# EAGLE design pokey (EAGLE 6.6.0)
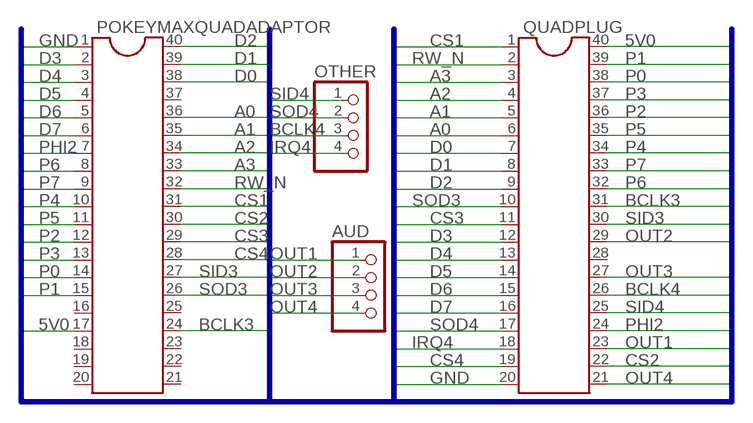
[diagram p0: schematic, sheet 1]

## Parts
AUD  PINHD-1X4  [1X04]
OTHER  PINHD-1X4  [1X04]
POKEYMAXQUADADAPTOR  DIL40  [DIL40]
QUADPLUG  DIL40  [DIL40]

## Nets
5V0: POKEYMAXQUADADAPTOR.17 QUADPLUG.40
A0: POKEYMAXQUADADAPTOR.36 QUADPLUG.6
A1: POKEYMAXQUADADAPTOR.35 QUADPLUG.5
A2: POKEYMAXQUADADAPTOR.34 QUADPLUG.4
A3: POKEYMAXQUADADAPTOR.33 QUADPLUG.3
BCLK3: POKEYMAXQUADADAPTOR.24 QUADPLUG.31
BCLK4: OTHER.3 QUADPLUG.26
CS1: POKEYMAXQUADADAPTOR.31 QUADPLUG.1
CS2: POKEYMAXQUADADAPTOR.30 QUADPLUG.22
CS3: POKEYMAXQUADADAPTOR.29 QUADPLUG.11
CS4: POKEYMAXQUADADAPTOR.28 QUADPLUG.19
D0: POKEYMAXQUADADAPTOR.38 QUADPLUG.7
D1: POKEYMAXQUADADAPTOR.39 QUADPLUG.8
D2: POKEYMAXQUADADAPTOR.40 QUADPLUG.9
D3: POKEYMAXQUADADAPTOR.2 QUADPLUG.12
D4: POKEYMAXQUADADAPTOR.3 QUADPLUG.13
D5: POKEYMAXQUADADAPTOR.4 QUADPLUG.14
D6: POKEYMAXQUADADAPTOR.5 QUADPLUG.15
D7: POKEYMAXQUADADAPTOR.6 QUADPLUG.16
GND: POKEYMAXQUADADAPTOR.1 QUADPLUG.20
IRQ4: OTHER.4 QUADPLUG.18
OUT1: AUD.1 QUADPLUG.23
OUT2: AUD.2 QUADPLUG.29
OUT3: AUD.3 QUADPLUG.27
OUT4: AUD.4 QUADPLUG.21
P0: POKEYMAXQUADADAPTOR.14 QUADPLUG.38
P1: POKEYMAXQUADADAPTOR.15 QUADPLUG.39
P2: POKEYMAXQUADADAPTOR.12 QUADPLUG.36
P3: POKEYMAXQUADADAPTOR.13 QUADPLUG.37
P4: POKEYMAXQUADADAPTOR.10 QUADPLUG.34
P5: POKEYMAXQUADADAPTOR.11 QUADPLUG.35
P6: POKEYMAXQUADADAPTOR.8 QUADPLUG.32
P7: POKEYMAXQUADADAPTOR.9 QUADPLUG.33
PHI2: POKEYMAXQUADADAPTOR.7 QUADPLUG.24
RW_N: POKEYMAXQUADADAPTOR.32 QUADPLUG.2
SID3: POKEYMAXQUADADAPTOR.27 QUADPLUG.30
SID4: OTHER.1 QUADPLUG.25
SOD3: POKEYMAXQUADADAPTOR.26 QUADPLUG.10
SOD4: OTHER.2 QUADPLUG.17
Unconnected: POKEYMAXQUADADAPTOR.16 POKEYMAXQUADADAPTOR.18 POKEYMAXQUADADAPTOR.19 POKEYMAXQUADADAPTOR.20 POKEYMAXQUADADAPTOR.21 POKEYMAXQUADADAPTOR.22 POKEYMAXQUADADAPTOR.23 POKEYMAXQUADADAPTOR.25 POKEYMAXQUADADAPTOR.37 QUADPLUG.28

## Buses
RW_N,PHI2,D[0..7],A[0..3],CS[1..4],OUT[1..4],P[0..7],5V0,GND,SOD3,SOD4,SID3,SID4,BCLK3,BCLK4,IRQ4

## Library data of the parts
AUD OTHER = max10:PINHD-1X4: PIN HEADER
POKEYMAXQUADADAPTOR QUADPLUG = ic-package:DIL40: Dual In Line

## Board
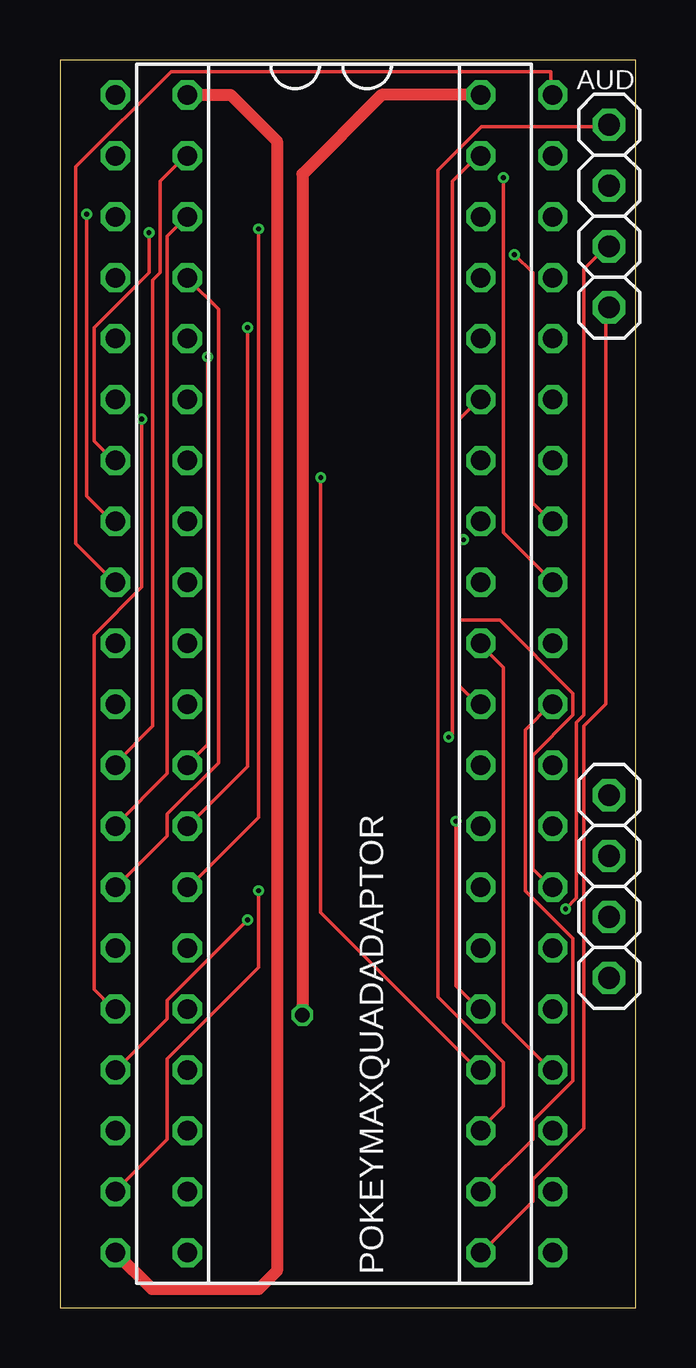
[diagram p1: board, top side]
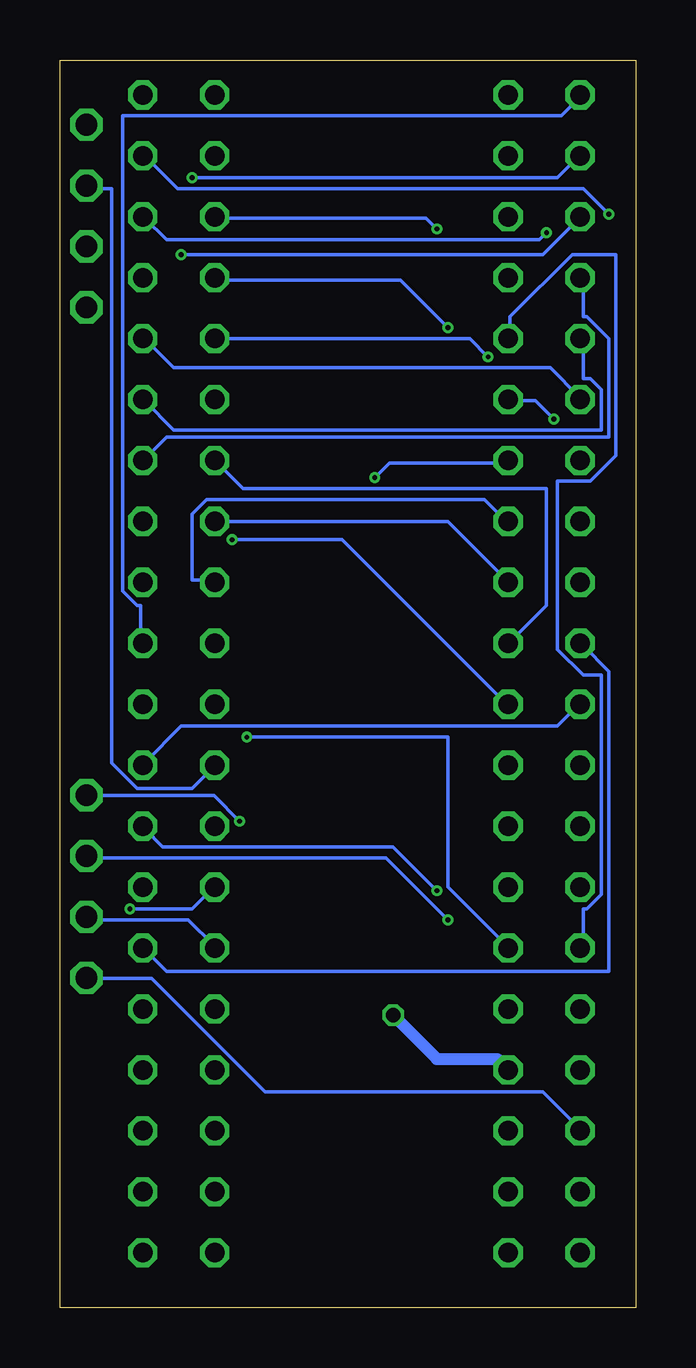
[diagram p2: board, bottom side, seen from below]

Size 24 x 52 mm. Coordinates in mm from the lower left corner, seen from the top.
Outline: 24,52 0,52 0,0 24,0 24,52
Copper layers (1*16): Top 0.035559375mm / dielectric 1.6mm / Bottom 0.035559375mm
Design rules "oshpark-2layer_via": minimum track width 6mil, minimum drill 0.2mm, track to track 6mil, track to pad 6mil, pad to pad 6mil, via to via 6mil, smd to smd 6mil, copper to edge 15mil, drill to drill 6mil, minimum pad ring 5mil, minimum via ring 5mil, stop-mask expansion 2.5mil, vias tented up to drill 9mil, thermal gap 10mil

### Footprints (pad centres in the part's own frame; a part is rotated, then mirrored left to right if it is on the bottom)
1X04 = drill 0.9 octagon: 1 -3.81,0; 2 -1.27,0; 3 1.27,0; 4 3.81,0
DIL40 = drill 0.813 octagon: 1 -24.13,-7.62; 2 -21.59,-7.62; 3 -19.05,-7.62; 4 -16.51,-7.62; 5 -13.97,-7.62; 6 -11.43,-7.62; 7 -8.89,-7.62; 8 -6.35,-7.62; 9 -3.81,-7.62; 10 -1.27,-7.62; 11 1.27,-7.62; 12 3.81,-7.62; 13 6.35,-7.62; 14 8.89,-7.62; 15 11.43,-7.62; 16 13.97,-7.62; 17 16.51,-7.62; 18 19.05,-7.62; 19 21.59,-7.62; 20 24.13,-7.62; 21 24.13,7.62; 22 21.59,7.62; 23 19.05,7.62; 24 16.51,7.62; 25 13.97,7.62; 26 11.43,7.62; 27 8.89,7.62; 28 6.35,7.62; 29 3.81,7.62; 30 1.27,7.62; 31 -1.27,7.62; 32 -3.81,7.62; 33 -6.35,7.62; 34 -8.89,7.62; 35 -11.43,7.62; 36 -13.97,7.62; 37 -16.51,7.62; 38 -19.05,7.62; 39 -21.59,7.62; 40 -24.13,7.62

### Placement (x,y rotation side)
AUD  22.9,45.49 270 top
OTHER  22.9,17.55 270 top
POKEYMAXQUADADAPTOR  12.93,26.42 270 top
QUADPLUG  9.93,26.42 270 top

### Tracks (layer width: path | path; a pad name or v marks a point on that pad's centre or on a via)
5V0  (via drill 0.6)
  Top 0.508: QUADPLUG.40 13.41,50.55 10.11,47.24 v10.11,12.19
  Bottom 0.508: v10.11,12.19 8.28,10.36 5.77,10.36 POKEYMAXQUADADAPTOR.17
A0
  Bottom 0.152: QUADPLUG.6 2.34,37.95 3.56,39.17 19.26,39.17 20.48,40.39 POKEYMAXQUADADAPTOR.36
A1
  Bottom 0.152: QUADPLUG.5 2.19,40.39 2.19,38.71 1.88,38.71 1.42,38.25 1.42,36.58 19.26,36.58 20.48,37.8 POKEYMAXQUADADAPTOR.35
A2
  Bottom 0.152: QUADPLUG.4 2.19,42.82 2.19,41.3 2.03,41.3 1.12,40.39 1.12,36.27 19.56,36.27 20.48,35.36 POKEYMAXQUADADAPTOR.34
A3  (via drill 0.2)
  Top 0.152: v18.95,43.89 19.71,43.13 19.71,33.53 20.48,32.77 POKEYMAXQUADADAPTOR.33
  Bottom 0.152: v18.95,43.89 3.86,43.89 2.34,45.41 QUADPLUG.3
BCLK3
  Top 0.152: POKEYMAXQUADADAPTOR.24 20.48,9.91 18.49,11.89 18.49,26.67 17.58,27.58 QUADPLUG.31
BCLK4
  Bottom 0.152: QUADPLUG.26 17.58,15.09 18.65,16.15 22.76,16.15 OTHER.3
CS1
  Bottom 0.152: POKEYMAXQUADADAPTOR.31 20.63,27.74 20.63,29.26 20.78,29.26 21.39,29.87 21.39,49.68 3.1,49.68 2.34,50.44 QUADPLUG.1
CS2
  Top 0.152: QUADPLUG.22 17.58,4.88 19.71,7.01 19.71,7.77 21.39,9.45 21.39,15.39 19.41,17.37 19.41,24.08 20.48,25.15 POKEYMAXQUADADAPTOR.30
CS3
  Bottom 0.152: QUADPLUG.11 2.34,25.15 3.25,24.23 18.95,24.23 20.48,22.71 POKEYMAXQUADADAPTOR.29
CS4  (via drill 0.2)
  Top 0.152: v8.28,17.37 8.28,14.17 4.47,10.36 4.47,7.01 2.34,4.88 QUADPLUG.19
  Bottom 0.152: v8.28,17.37 10.11,19.2 19.71,19.2 20.48,19.96 POKEYMAXQUADADAPTOR.28
D0  (via drill 0.2)
  Top 0.152: v3.71,44.81 3.71,43.13 1.42,40.84 1.42,36.12 2.19,35.36 QUADPLUG.7
  Bottom 0.152: v3.71,44.81 4.02,44.5 19.56,44.5 20.48,45.41 POKEYMAXQUADADAPTOR.38
D1  (via drill 0.2)
  Top 0.152: v1.12,45.57 1.12,33.83 2.19,32.77 QUADPLUG.8
  Bottom 0.152: v1.12,45.57 2.19,46.63 19.1,46.63 20.48,48.01 POKEYMAXQUADADAPTOR.39
D2
  Top 0.152: QUADPLUG.9 2.19,30.33 0.66,31.85 0.66,47.55 4.62,51.51 20.48,51.51 20.48,50.6 POKEYMAXQUADADAPTOR.40
D3
  Top 0.152: QUADPLUG.12 2.34,22.71 3.86,24.23 3.86,42.82 4.17,43.13 4.17,46.94 5.23,48.01 POKEYMAXQUADADAPTOR.2
D4
  Top 0.152: QUADPLUG.13 2.34,20.12 4.47,22.25 4.47,44.65 5.23,45.41 POKEYMAXQUADADAPTOR.3
D5
  Top 0.152: QUADPLUG.14 2.34,17.53 4.47,19.66 4.47,20.57 6.61,22.71 6.61,41.6 5.39,42.82 POKEYMAXQUADADAPTOR.4
D6
  Bottom 0.152: QUADPLUG.15 2.19,15.09 2.19,16.61 2.03,16.61 1.42,17.22 1.42,26.36 2.19,26.36 3.25,27.43 3.25,34.44 1.88,34.44 0.82,35.51 0.82,43.89 2.64,43.89 5.23,41.3 5.23,40.39 POKEYMAXQUADADAPTOR.5
D7  (via drill 0.2)
  Top 0.152: v3.41,37.03 3.41,30.02 1.42,28.04 1.42,13.26 2.19,12.5 QUADPLUG.16
  Bottom 0.152: v3.41,37.03 4.17,37.8 5.23,37.8 POKEYMAXQUADADAPTOR.6
GND
  Top 0.508: POKEYMAXQUADADAPTOR.1 7.11,50.55 9.04,48.62 9.04,1.52 8.28,0.76 3.84,0.76 QUADPLUG.20
IRQ4
  Bottom 0.152: QUADPLUG.18 2.34,7.47 3.86,8.99 15.45,8.99 20.17,13.72 22.76,13.72 OTHER.4
OUT1
  Top 0.152: QUADPLUG.23 17.58,7.47 18.49,8.38 18.49,10.21 15.75,12.95 15.75,47.4 17.58,49.23 22.76,49.23 AUD.1
OUT2
  Bottom 0.152: QUADPLUG.29 17.58,22.55 18.49,21.64 20.78,21.64 21.85,22.71 21.85,46.63 22.76,46.63 AUD.2
OUT3  (via drill 0.2)
  Top 0.152: v21.08,16.61 21.54,17.07 21.54,24.38 21.85,24.69 21.85,43.28 22.76,44.2 AUD.3
  Bottom 0.152: v21.08,16.61 18.49,16.61 17.58,17.53 QUADPLUG.27
OUT4
  Top 0.152: QUADPLUG.21 17.58,2.29 19.71,4.42 19.71,5.33 21.85,7.47 21.85,24.23 22.76,25.15 22.76,41.6 AUD.4
P0  (via drill 0.2)
  Top 0.152: v8.28,44.96 8.28,20.42 5.39,17.53 POKEYMAXQUADADAPTOR.14
  Bottom 0.152: v8.28,44.96 8.74,45.41 17.43,45.41 QUADPLUG.38
P1  (via drill 0.2)
  Top 0.152: v16.21,23.77 16.36,23.93 16.36,46.94 17.43,48.01 QUADPLUG.39
  Bottom 0.152: v16.21,23.77 7.83,23.77 7.83,17.53 5.39,15.09 POKEYMAXQUADADAPTOR.15
P2  (via drill 0.2)
  Top 0.152: v6.15,39.62 6.15,23.47 5.39,22.71 POKEYMAXQUADADAPTOR.12
  Bottom 0.152: v6.15,39.62 6.91,40.39 QUADPLUG.36
P3  (via drill 0.2)
  Top 0.152: v7.83,40.84 7.83,22.55 5.39,20.12 POKEYMAXQUADADAPTOR.13
  Bottom 0.152: v7.83,40.84 9.81,42.82 17.43,42.82 QUADPLUG.37
P4
  Bottom 0.152: POKEYMAXQUADADAPTOR.10 5.23,27.74 3.71,29.26 3.71,34.14 16.36,34.14 17.43,35.2 QUADPLUG.34
P5  (via drill 0.2)
  Top 0.152: v16.82,32 16.66,32.16 16.66,37.03 17.43,37.8 QUADPLUG.35
  Bottom 0.152: v16.82,32 12.25,32 5.39,25.15 POKEYMAXQUADADAPTOR.11
P6
  Bottom 0.152: POKEYMAXQUADADAPTOR.8 5.39,32.77 6.3,33.68 17.88,33.68 18.49,33.07 18.49,30.33 17.58,30.33 QUADPLUG.32
P7
  Bottom 0.152: QUADPLUG.33 7.83,32.77 5.39,30.33 POKEYMAXQUADADAPTOR.9
PHI2  (via drill 0.2)
  Top 0.152: v10.87,34.59 10.87,16.46 17.43,9.91 QUADPLUG.24
  Bottom 0.152: v10.87,34.59 10.26,35.2 5.39,35.2 POKEYMAXQUADADAPTOR.7
RW_N  (via drill 0.2)
  Top 0.152: v18.49,47.09 18.49,32.31 20.48,30.33 POKEYMAXQUADADAPTOR.32
  Bottom 0.152: v18.49,47.09 3.25,47.09 2.34,48.01 QUADPLUG.2
SID3
  Top 0.152: POKEYMAXQUADADAPTOR.27 20.48,17.53 19.71,18.29 19.71,23.01 21.39,24.69 21.39,25.6 18.34,28.65 16.66,28.65 16.66,25.91 17.43,25.15 QUADPLUG.30
SID4  (via drill 0.2)
  Top 0.152: v16.51,20.27 16.51,13.41 17.43,12.5 QUADPLUG.25
  Bottom 0.152: v16.51,20.27 17.58,21.34 22.76,21.34 OTHER.1
SOD3
  Bottom 0.152: QUADPLUG.10 2.19,27.58 1.12,26.52 1.12,14.02 19.56,14.02 20.48,14.94 POKEYMAXQUADADAPTOR.26
SOD4  (via drill 0.2)
  Top 0.152: v7.83,16.15 4.47,12.8 4.47,12.04 2.34,9.91 QUADPLUG.17
  Bottom 0.152: v7.83,16.15 10.42,18.75 22.76,18.75 OTHER.2